# EAGLE design Narrow GPS Board for Radio (EAGLE 9.7.0)
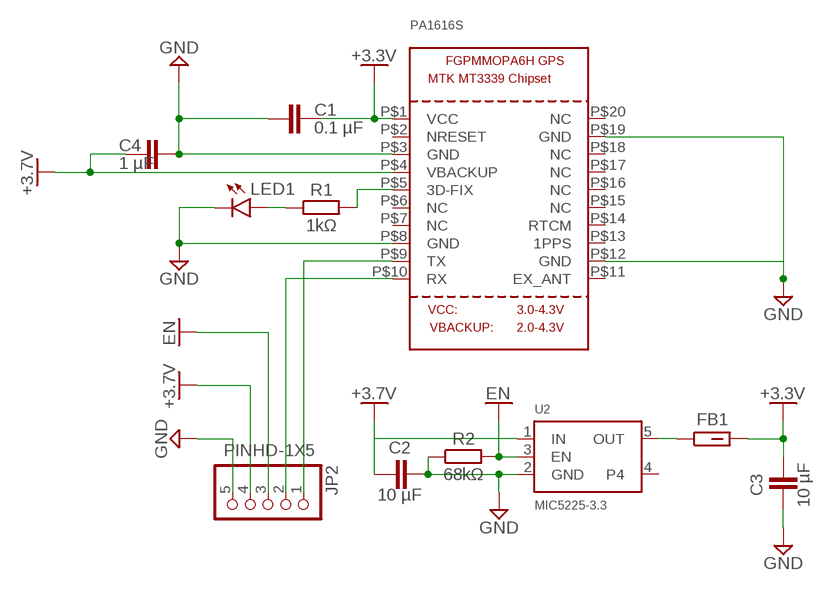
[diagram p0: schematic, sheet 1]

## Parts
C1  0.1 µF  CAP-0805  [0805]
C2  10 µF  CAP-0805  [0805]
C3  10 µF  CAP-0805  [0805]
C4  1 µF  CAP-0805  [0805]
FB1  600 Ohms @ 100 MHz  FBCHIP-0805(2012-METRIC)  [BEADC2012X105N]
JP2  PINHD-1X5  [1X05]
LED1  LED_RED  CHIP-FLAT-R_0805  [LEDC2012X110N_FLAT-R]
PA1616S  GPS_FGPMMOPA6H  [FGPMMOPA6H]
R1  1kΩ  R_CHIP-0805(2012-METRIC)  [RESC2012X65]
R2  68kΩ  R_CHIP-0805(2012-METRIC)  [RESC2012X65]
U2  MIC5225-3.3  VREG_SOT23-5  [SOT23-5]

## Nets
+3.3V: C1.1 C3.2 FB1.2 PA1616S.P$1(VCC)
+3.7V: C2.1 C4.2 JP2.4 PA1616S.P$4(VBACKUP) U2.1(IN)
EN: JP2.3 R2.2 U2.3(EN)
FIX: PA1616S.P$5(3D-FIX) R1.2
GND: C1.2 C2.2 C3.1 C4.1 JP2.5 LED1.C PA1616S.P$3(GND) PA1616S.P$8(GND) PA1616S.P$12(GND) PA1616S.P$19(GND) R2.1 U2.2(GND)
N$6: LED1.A R1.1
OUT: FB1.1 U2.5(OUT)
RX: JP2.2 PA1616S.P$10(RX)
TX: JP2.1 PA1616S.P$9(TX)
Unconnected: PA1616S.P$2(NRESET) PA1616S.P$6(NC) PA1616S.P$7(NC) PA1616S.P$11(EX_ANT) PA1616S.P$13(1PPS) PA1616S.P$14(RTCM) PA1616S.P$15(NC) PA1616S.P$16(NC) PA1616S.P$17(NC) PA1616S.P$18(NC) PA1616S.P$20(NC) U2.4

## Library data of the parts
C1-C4 = SparkFun-Capacitors:CAP
FB1 = Filter:FB: Ferrite Bead - Generic; CATEGORY: Filter; SUB-CATEGORY: Ferrite bead; VALUE: FERRITE_BEAD
JP2 = Connector:PINHD-1X5: PIN HEADER; CATEGORY: Headers; DESCRIPTION: Header, Straight, 5 Position; MANUFACTURER: Generic; MPN: Generic; OPERATING_TEMPERATURE: Generic; PART_STATUS: Active; PITCH: 0.100" (2.54mm); ROHS_COMPLIANCE: Generic; SERIES: Generic; SUB-CATEGORY: Headers, Male Pins; TYPE: Board to Board or Cable, Unshrouded, Through Hole, Straight
LED1 = LED:CHIP-FLAT-R; CATEGORY: LED; COLOR: RED; DESCRIPTION: CHIP LED FLAT; SUB-CATEGORY: CHIP; TYPE: FLAT_TOP
PA1616S = adafruit:GPS_FGPMMOPA6H: GPS Module - MTK MT3339 Chipset, -165dBm sensitivity, 22 channels, 10Hz, auto-select external antenna options
R1 R2 = Resistor:R: Resistor Fixed - Generic; CATEGORY: Resistor; SUB-CATEGORY: Fixed
U2 = microbuilder:VREG_SOT23-5: SOT23-5 Fixed Voltage Regulators Part Current Out V Out V In V Dropout θJA (°C/W) TJ (°C) Digikey Part No. ADP121 150mA 3.3V 3.4-5.5V 0.09V @ 150mA -- -- ADP121-AUJZ33R7CT-ND ADP121 150mA 3.0V 3.1-5.5V 0.09V @ 150mA -- -- ADP121-AUJZ30R7CT-ND ADP122 300mA 3.3V 3.4-5.5V 0.085V @ 300mA -- -- ADP122AUJZ-3.3-R7CT-ND ADP1712 300mA 3.3V 3.5-5.5V 0.17V @ 300mA -- -- ADP1712AUJZ-3.3-R7TR-ND AP7311 (Low Cost) 150mA 3.3V 3.5-6V 0.15V @ 150mA -- -- AP7311-33WG-7DICT-ND LD39015M18R 150mA 1.8V 1.9V-5.5V 0.08V @ 100mA -- -- 497-6977-1-ND LP2985A-33DBVR 150mA 3.3V 3.3-16V 0.28V @ 150mA 206 150 296-18479-1-ND MCP1824T-3302E/OT 300mA 3.3V 3.5V-6V 0.2V @ 300mA -- -- MCP1824T-3302E/OTCT-ND MIC5205-2.5YM5 TR 150mA 2.5V 2.7-16V 0.165V @ 150mA -- -- 576-1257-2-ND MIC5205-3.0YM5 TR 150mA 3.0V 3.2V-16V 0.165V @ 150mA -- -- 576-1258-2-ND MIC5205-3.3YM5 TR 150mA 3.3V 3.5V-16V 0.165V @ 150mA -- -- 576-1259-2-ND TPS780330220 150mA 3.3V+2.2V 3.6-5.5V 250mV Max -- -- 296-23332-1-ND TDA3663/N1,135 100mA 3.3V 3.5-45V 0.18V @ 50mA -- -- 568-5343-1-ND Max operating temp can be calculated using θJA, TJ (max junction temperature), and power in watts. Set the "Maximum Ambient Temperature" until it reaches TJ ("Max Junction Temperature"), which is the absolute limit for safe use of the regulator: Heat Sink Temperature Calculator <http://www.daycounter.com/Calculators/Heat-Sink-Temperature-Calculator.phtml> For example, With 12V source into a 3.3V LP2985 and a 30mA load, we are dissipating (12V-3.3V) * 0.03A = 0.261W. With a θJA of 206 °C/W, a TJ of 150°C, and 261mW we can safely use the chip without a heat sink up to 75°C (=147.1°C Junction Temperature).

## Board
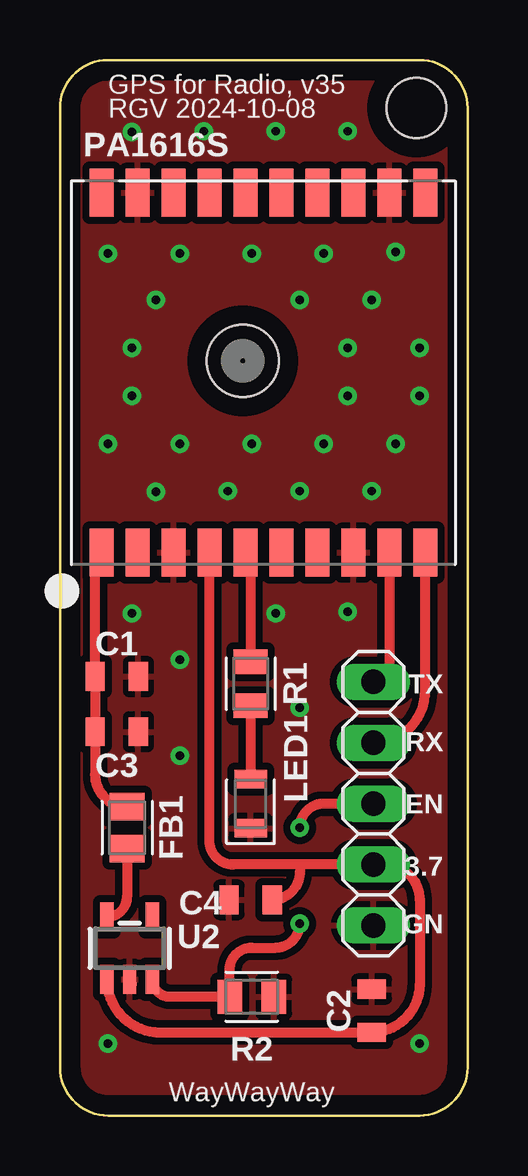
[diagram p1: board, top side]
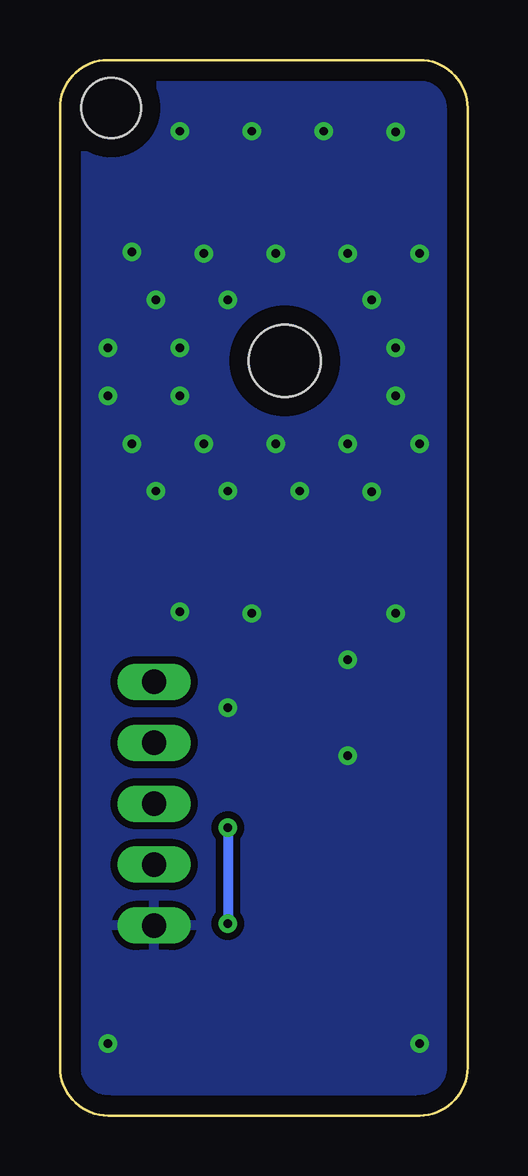
[diagram p2: board, bottom side, seen from below]

Size 17 x 44 mm. Coordinates in mm from the lower left corner, seen from the top.
Outline: 15,44 arc-90 17,42 17,2 arc-90 15,0 2,0 arc-90 0,2 0,42 arc-90 2,44 15,44
Copper layers (1*16): Top 0.035mm / dielectric 1.5mm / Bottom 0.035mm
Design rules "Fusion Electronics Design Rules": minimum track width 6mil, minimum drill 0.35mm, track to track 6mil, track to pad 6mil, pad to pad 6mil, via to via 6mil, smd to smd 6mil, copper to edge 0.8mm, drill to drill 6mil, minimum pad ring 10mil, minimum via ring 8mil, stop-mask expansion 4mil, vias tented up to drill 0mil, thermal gap 10mil
Holes 2.5 mm at 14.86,42

### Footprints (pad centres in the part's own frame; a part is rotated, then mirrored left to right if it is on the bottom)
0805 = smd 0.8 x 1.2: 1 -0.9,0; 2 0.9,0
BEADC2012X105N = smd 1.165 x 1.465: 1 -0.875,0; 2 0.875,0
1X05 = drill 1.016 long: 1 -5.08,0; 2 -2.54,0; 3 0,0; 4 2.54,0; 5 5.08,0
LEDC2012X110N_FLAT-R = smd 0.762 x 1.362: A 1.025,0; C -1.025,0
FGPMMOPA6H = smd 2 x 1: P$1 -7.5,6.75; P$2 -7.5,5.25; P$3 -7.5,3.75; P$4 -7.5,2.25; P$5 -7.5,0.75; P$6 -7.5,-0.75; P$7 -7.5,-2.25; P$8 -7.5,-3.75; P$9 -7.5,-5.25; P$10 -7.5,-6.75; P$11 7.5,-6.75; P$12 7.5,-5.25; P$13 7.5,-3.75; P$14 7.5,-2.25; P$15 7.5,-0.75; P$16 7.5,0.75; P$17 7.5,2.25; P$18 7.5,3.75; P$19 7.5,5.25; P$20 7.5,6.75 | hole 3: 0.5,0.85
RESC2012X65 = smd 1.031 x 1.42: 1 -0.919,0; 2 0.919,0
SOT23-5 = smd 0.55 x 1.2: 1 -0.95,-1.3; 2 0,-1.3; 3 0.95,-1.3; 4 0.95,1.3; 5 -0.95,1.3

### Placement (x,y rotation side)
C1  2.37,18.3 0 top
C2  13,4.37 90 top
C3  2.37,16 180 top
C4  7.95,8.99 0 top
FB1  2.8,12 90 top
JP2  13.07,13 270 top
LED1  7.95,13 90 top
PA1616S  8.48,30.96 90 top
R1  7.95,18 90 top
R2  8,4.95 180 top
U2  2.91,6.98 0 top

### Tracks (layer width: path | path; a pad name or v marks a point on that pad's centre or on a via)
+3.3V
  Top 0.406: FB1.2 arc-90 1.47,14.21 C3.2 C1.1 1.47,23.2 arc-90 PA1616S.P$1
+3.7V
  Top 0.406: U2.1 arc90 4.17,3.47 C2.1 arc90 15,5.47 15,9 arc90 13.54,10.46 JP2.4 10,10.46 | PA1616S.P$4 6.23,11.46 arc90 7.23,10.46 10,10.46 | 10,10.46 10,10.14 arc-90 C4.2
EN  (via drill 0.35)
  Top 0.406: JP2.3 11,13 arc90 v10,12 | v10,8 arc-90 9,7 8,7 arc90 7.08,6.08 R2.2 4.58,4.95 arc-90 U2.3
  Bottom 0.406: v10,12 v10,8
FIX
  Top 0.406: PA1616S.P$5 arc-90 7.95,23.24 R1.2
GND  (via drill 0.35)
  Top 0.406: C1.2 3.3,18.3 | 3,5.45 arc45 U2.2
  other vias: 12,21 3,41 6,41.03 9,41.03 12,41.03 14,36 4,34 10,34 13,34 12,32 15,32 3,32 2,28 5,28 8,28 11,28 14,28 4,26 7,26.03 10,26.03 13,26.03 5,19 2,35.93 5,35.93 8,35.93 11,35.93 9,20.93 3,20.93 2,3 15,3 5,15 10,17 3,30 12,30 15,30
  pour Bottom (isolate 0.305): -0.8,-0.8 17.8,-0.8 17.8,44.8 -0.8,44.8
  pour Top (isolate 0.305): 1,-0.95 16,-0.95 16.3,-0.93 16.6,-0.85 16.88,-0.74 17.15,-0.58 17.38,-0.38 17.58,-0.15 17.74,0.12 17.85,0.4 17.93,0.7 17.95,1 17.95,43 17.93,43.3 17.85,43.6 17.74,43.88 17.58,44.15 17.38,44.38 17.15,44.58 16.88,44.74 16.6,44.85 16.3,44.93 16,44.95 1,44.95 0.7,44.93 0.4,44.85 0.12,44.74 -0.15,44.58 -0.38,44.38 -0.58,44.15 -0.74,43.88 -0.85,43.6 -0.93,43.3 -0.95,43 -0.95,1 -0.93,0.7 -0.85,0.4 -0.74,0.12 -0.58,-0.15 -0.38,-0.38 -0.15,-0.58 0.12,-0.74 0.4,-0.85 0.7,-0.93
N$6
  Top 0.406: 7.93,17.05 R1.1 LED1.A
OUT
  Top 0.406: 2.96,10.75 arc45 FB1.1 2.8,9.12 arc-90 U2.5
RX
  Top 0.406: JP2.2 arc90 15.23,17.7 PA1616S.P$10
TX
  Top 0.406: JP2.1 arc90 13.73,18.74 PA1616S.P$9
(copper drawn outside any net)
  shapes: Bottom area x1, Top area x1

### Text on the board
tPlace: GPS for Radio, v35 | RGV 2024-10-08 | TX | RX | EN | 3.7 | GN | WayWayWay